# Altium schematic sheet LCD4.3.SchDoc: LCD4.3
size A4; CompanyName: STMicroelectronics; Organization: Microcontrollers Division; DocumentNumber: 16; SheetNumber: 2; SheetTotal: 4
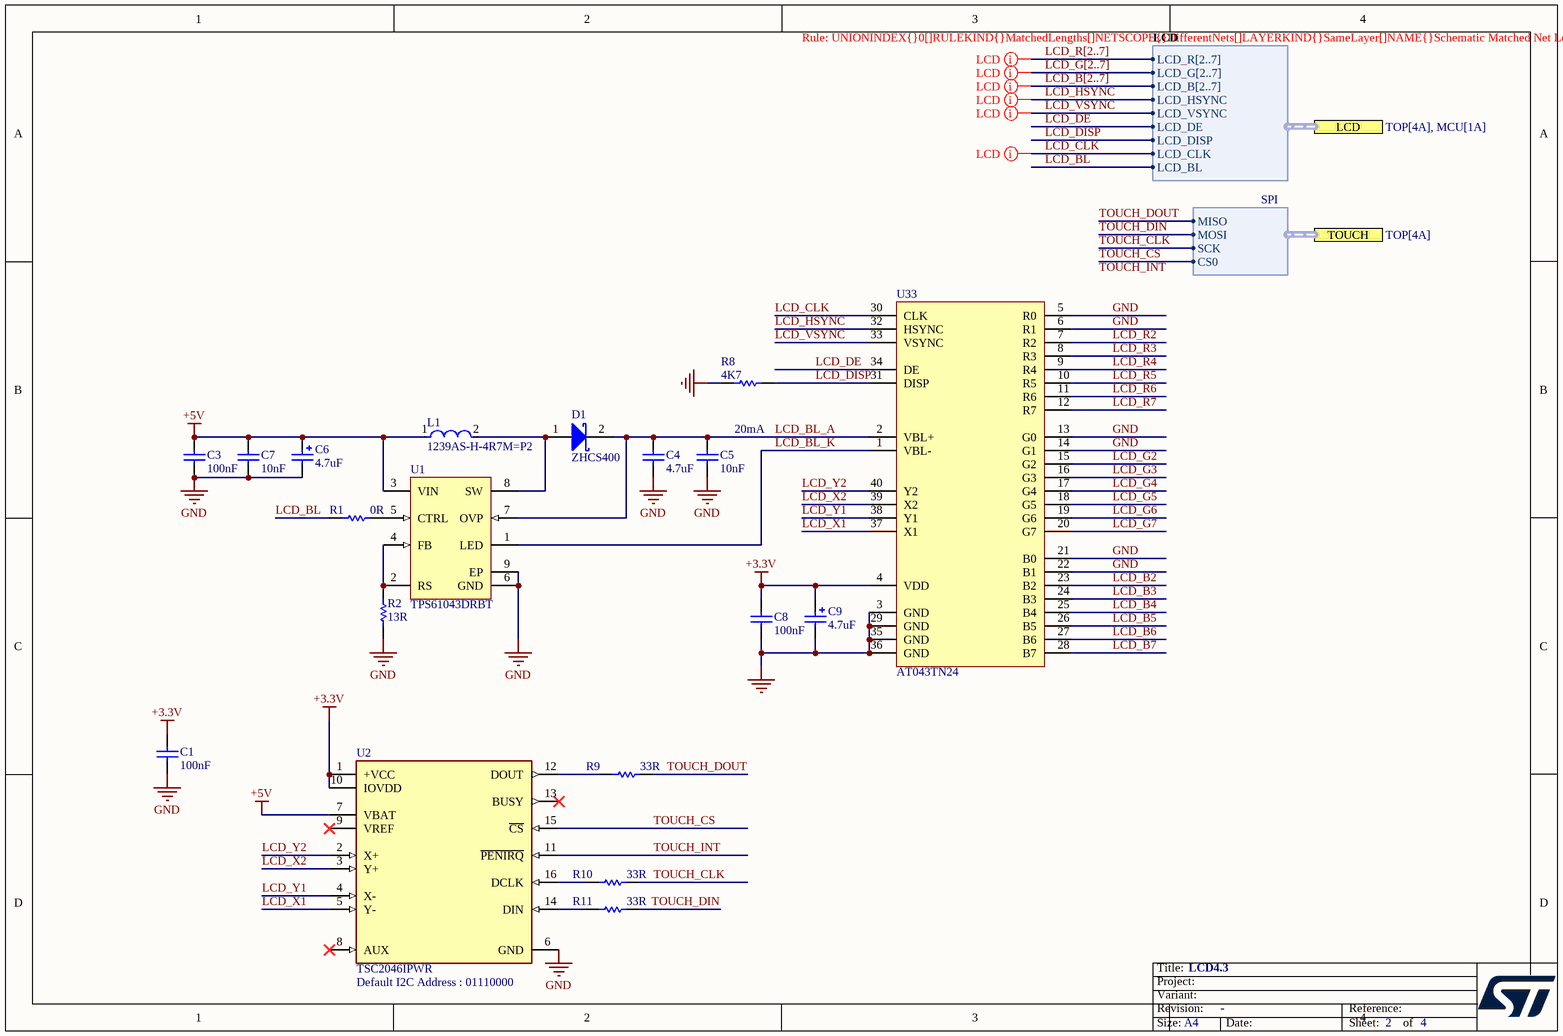
[diagram p0: LCD4.3.SchDoc]

## Parts
C1  value 100nF  [C603]  (hidden comment: Capacitor)
C3  value 100nF  [C603]  (hidden comment: Capacitor)
C4  value 4.7uF  [C1206]  (hidden comment: Capacitor)
C5  value 10nF  [C603]  (hidden comment: Capacitor)
C6  value 4.7uF  [CAP-TAN-A]  (hidden comment: Cap_POL_TANA)
C7  value 10nF  [C603]  (hidden comment: Capacitor)
C8  value 100nF  [C603]  (hidden comment: Capacitor)
C9  value 4.7uF  [CAP-TAN-A]  (hidden comment: Cap_POL_TANA)
D1  ZHCS400  [DIOD-SOD323-2_V]
L1  1239AS-H-4R7M=P2  [FP-DFE252012C-IPC_A]
R1  value 0R  [R0603]  (hidden comment: Resistor)
R2  value 13R  [R805]  (hidden comment: Resistor)
R8  value 4K7  [R0603]  (hidden comment: Resistor)
R9  value 33R  [R0603]  (hidden comment: Resistor)
R10  value 33R  [R0603]  (hidden comment: Resistor)
R11  value 33R  [R0603]  (hidden comment: Resistor)
U1  TPS61043DRBT  [DRB0008A_V]
U2  TSC2046IPWR  [FP-PW0016A-IPC_B]
U33  AT043TN24  [FPC-40]

## Ports
LCD (harness LCD, see TOP[4A], MCU[1A]), TOUCH (harness SPI, see TOP[4A])

## Harnesses
LCD: LCD_R[2..7], LCD_G[2..7], LCD_B[2..7], LCD_HSYNC, LCD_VSYNC, LCD_DE, LCD_DISP, LCD_CLK, LCD_BL
SPI: MOSI, MISO, SCK, CS0

## Nets
+3.3V: C1.2 C8.2 C9.1 U2.1(+VCC) U2.10(IOVDD) U33.4(VDD)
+5V: C3.2 C6.1 C7.2 L1.1 U1.3(VIN) U2.7(VBAT)
GND: C1.1 C3.1 C4.1 C5.1 C6.2 C7.1 C8.1 C9.2 R2.1 R8.1 U1.6(GND) U1.9(EP) U2.6(GND) U33.3(GND) U33.5(R0) U33.6(R1) U33.13(G0) U33.14(G1) U33.21(B0) U33.22(B1) U33.29(GND) U33.35(GND) U33.36(GND)
LCD_B2: U33.23(B2)
LCD_B3: U33.24(B3)
LCD_B4: U33.25(B4)
LCD_B5: U33.26(B5)
LCD_B6: U33.27(B6)
LCD_B7: U33.28(B7)
LCD_BL: R1.1 ; port LCD.LCD_BL
LCD_BL_A: C4.2 C5.2 D1.2(K) U1.7(OVP) U33.2(VBL+)
LCD_BL_K: U1.1(LED) U33.1(VBL-)
LCD_CLK: U33.30(CLK) ; port LCD.LCD_CLK
LCD_DE: U33.34(DE) ; port LCD.LCD_DE
LCD_DISP: R8.2 U33.31(DISP) ; port LCD.LCD_DISP
LCD_G2: U33.15(G2)
LCD_G3: U33.16(G3)
LCD_G4: U33.17(G4)
LCD_G5: U33.18(G5)
LCD_G6: U33.19(G6)
LCD_G7: U33.20(G7)
LCD_HSYNC: U33.32(HSYNC) ; port LCD.LCD_HSYNC
LCD_R2: U33.7(R2)
LCD_R3: U33.8(R3)
LCD_R4: U33.9(R4)
LCD_R5: U33.10(R5)
LCD_R6: U33.11(R6)
LCD_R7: U33.12(R7)
LCD_VSYNC: U33.33(VSYNC) ; port LCD.LCD_VSYNC
LCD_X1: U2.5(Y-) U33.37(X1)
LCD_X2: U2.3(Y+) U33.39(X2)
LCD_Y1: U2.4(X-) U33.38(Y1)
LCD_Y2: U2.2(X+) U33.40(Y2)
TOUCH_CLK: R10.2 ; port TOUCH.SCK
TOUCH_CS: U2.15(~{CS}) ; port TOUCH.CS0
TOUCH_DIN: R11.2 ; port TOUCH.MOSI
TOUCH_DOUT: R9.2 ; port TOUCH.MISO
TOUCH_INT: U2.11(~{PENIRQ})
NetD1_1: D1.1(A) L1.2 U1.8(SW)
NetR1_2: R1.2 U1.5(CTRL)
NetR2_2: R2.2 U1.2(RS) U1.4(FB)
NetR9_1: R9.1 U2.12(DOUT)
NetR10_1: R10.1 U2.16(DCLK)
NetR11_1: R11.1 U2.14(DIN)

Not connected (* = marked no-connect by the designer): U2 8(AUX)* 9(VREF)* 13(BUSY)*

## Buses and harness runs
bus LCD_B[2..7]
bus LCD_G[2..7]
bus LCD_R[2..7]

## Layout directives
rule Matched Net Lengths [Tolerance = 100mil]; net class LCD: (no net found under the mark), LCD_CLK, LCD_HSYNC, LCD_VSYNC

## Notes on the sheet
- 20mA
- (near U2) Default I2C Address : 01110000
- Labels drawn without touching a wire or pin: TOUCH_INT
- Title:
- Project:
- Size:
- Revision:
- Variant:
- A4
- -
- Date:
- Reference:
- Sheet:
- of

## Library data of the parts
C1 C3 C8 = MCD-00102: Capacitor, MLCC, 100nF, 16V, X7R, 10%, 0402, T=0,5mm; Manufacturer_Part_Number: CC0402KRX7R7BB104; Manufacturer: YAGEO; Provided_By: Subcon; Initial_Board_Reference: MB1262; Internal_Part_Number: MCD-00102; Status: Released; Part_Type: Capacitor; Package: C0402; ComponentLink1Description: Yageo_Capacitor_X7R-series.pdf; ComponentLink1URL: http://tunmcdsvn.tun.st.com/Component_Datasheet_Library/Trunk/Capacitors/Yageo_Multilayer_Capacitor_X7R_series_100pF_to_22uF; ECCN_US: n/a; ECCN_EU: n/a
C4 = MCD-00013: Capacitor, MLCC, 4.7uF, 50V, X7R, 10%, 1206, T=1,27mm; Manufacturer_Part_Number: 12065C475KAT2A; Manufacturer: AVX; Provided_By: Subcon; Initial_Board_Reference: MB1274; Internal_Part_Number: MCD-00013; Status: Released; Part_Type: Capacitor; Package: C1206; ComponentLink1Description: AVX_Capacitor_C0G-NP0-series.pdf; ComponentLink1URL: http://tunmcdsvn.tun.st.com/Component_Datasheet_Library/Trunk/Capacitors/AVX_Capacitor_C0G-NP0-series; ECCN_US: n/a; ECCN_EU: n/a
C5 C7 = MCD-00017: Capacitor, MLCC, 10nF, 50V, X7R, 10%, 0603, T=0.8mm; Manufacturer_Part_Number: CC0603KRX7R9BB103; Manufacturer: YAGEO; Provided_By: Subcon; Initial_Board_Reference: MB1274; Internal_Part_Number: MCD-00017; Status: Released; Part_Type: Capacitor; Package: C0603; ComponentLink1Description: Yageo_Capacitor_X7R-series.pdf; ComponentLink1URL: http://tunmcdsvn.tun.st.com/Component_Datasheet_Library/Trunk/Capacitors/Yageo_Multilayer_Capacitor_X7R_series_100pF_to_22uF; ECCN_US: n/a; ECCN_EU: n/a
C6 C9 = MCD-00595: Capacitor, Tantalum, 4.7uF, 16V, +/-10%, 595D case A; Manufacturer_Part_Number: 595D475X9016A2T; Manufacturer: VISHAY; Order_Code_RS: 117-303; Provided_By: Subcon; Initial_Board_Reference: MB1331; Revision: July-2002: Re-released for DXP Platform.; Internal_Part_Number: MCD-00595; Status: Footprint available; Part_Type: Capacitor; ComponentLink1Description: VISHAY_CAPACITOR_TANTALUM_595D.pdf; ComponentLink1URL: http://tunmcdsvn.tun.st.com/Component_Datasheet_Library/Trunk/Capacitors/VISHAY_CAPACITOR_TANTALUM_595D; Order_Code_Digikey: 595D475X9016A2T-ND; Order_Code_Farnell: 1166805
D1 = CMP-0303-00001-1: Schottky Diode, 400mA; Manufacturer: Diodes Inc; Reverse Voltage: 40 V; Power Dissipation: 250 mW; Reverse Current: 40 uA@Vr=30 V; Packing Type: Tape and Reel; Forward Voltage: 425 mV@If=400 mA; PartNumber: ZHCS400; ComponentLink3URL: http://www.diodes.com/datasheets/ap02002.pdf; Moisture Sensitivity Level: 1; ComponentLink2URL: http://www.diodes.com/datasheets/ZHCS400.pdf; PackageDescription: 2-Pin SMT Diode, 1.7 x 1.3 mm Body; ComponentLink2Description: Datasheet; PackageReference: SOD323; ComponentLink1Description: Manufacturer URL; Mounting Technology: Surface Mount; DatasheetVersion: Rev. 8-2, 03/2012; ComponentLink1URL: http://www.diodes.com/; Storage Temperature: -55 to 150 degC; ComponentLink3Description: Package Specification; PackageVersion: Rev. 73
L1 = CMP-06042-003985-1: Shielded Wirewound Inductor 4.7uH 20% 1300mA 0.24Ω 1008 (2520); Current Rating: 1.5A; Core Material: Ferrite; DC Resistance (DCR): 240mR; Test Frequency: 1MHz; Resistor Type: Wirewound; Mount: Surface Mount; Case/Package: 1008; Case Code (Metric): 2520; Inductance: 4.7uH; Width: 0.079inch; Min Operating Temperature: -40°C; Height - Seated (Max): 0.047inch; Length: 0.098inch; Max Operating Temperature: 85°C; Tolerance: 20%; Case Code (Imperial): 1008; Shielding: Shielded; Packaging: Tape and Reel
R1 = MCD-00181: Resistor,0R,0603,ULO; Manufacturer_Part_Number: PMR03EZPJ000; Manufacturer: ROHM; Provided_By: Subcon; Internal_Part_Number: MCD-00181; Status: Released; Part_Type: Resistor; Package: R0603; ComponentLink1Description: ROHM_ULtra low Ohmic Resistor _PMR10EZPJ000.pdf; ComponentLink1URL: http://tunmcdsvn.tun.st.com/Component_Datasheet_Library/Trunk/Resistors/ROHM_ULtra low Ohmic Resistor _PMR10EZPJ000.pdf; ECCN_US: n/a; ECCN_EU: n/a
R2 = MCD-01111: Resistor,10R,0805,1%,Stackpole,1/4W; Manufacturer_Part_Number: RNCP0805FTD10R0; Provided_By: Subcon; Initial_Board_Reference: MB1381; Internal_Part_Number: MCD-01111; Status: Footprint available; Part_Type: Resistor; Manufacturer: STACKPOLE; Package: R0805; ComponentLink1Description: Stackpole_Resisteor_RNCP Series.pdf; ComponentLink1URL: http://tunmcdsvn.tun.st.com/Component_Datasheet_Library/Trunk/Resistors/Stackpole_Resisteor_RNCP%20Series/Stackpole_Resisteor_RNCP%20Series.pdf; ECCN_US: n/a; ECCN_EU: n/a
R8 = MCD-00219: Resistor,4K7,0603,1%,1/10W; Manufacturer_Part_Number: RC0603FR-074K7L; Manufacturer: YAGEO; Provided_By: Subcon; Initial_Board_Reference: mb1319; Internal_Part_Number: MCD-00219; Status: Released; Part_Type: Resistor; Package: R0603; ComponentLink1Description: Yageo_Resistor_RC0603-series.pdf; ComponentLink1URL: http://tunmcdsvn.tun.st.com/Component_Datasheet_Library/Trunk/Resistors/Yageo_Resistor_RC0603-series.pdf; ECCN_US: n/a; ECCN_EU: n/a
R9-R11 = MCD-00455: Resistor,33R,0402,1%,1/16W; Manufacturer_Part_Number: RC0402FR-0733RL; Manufacturer: YAGEO; Provided_By: Subcon; Internal_Part_Number: MCD-00455; Status: Released; Part_Type: Resistor; Package: R0402; ComponentLink1Description: Yageo_Resistor_RC0402-series.pdf; ComponentLink1URL: http://tunmcdsvn.tun.st.com/Component_Datasheet_Library/Trunk/Resistors/Yageo_Resistor_RC0402-series; ECCN_US: n/a; ECCN_EU: n/a
U1 = CMP-0343-00068-4: Boost LED Driver with 1.8 to 6 V Input and 1.8 to 16.9 V Output, -40 to 85 degC, 8-Pin SON (DRB), Green (RoHS & no Sb/Br); Manufacturer: Texas Instruments; Vout(Min)(V): 1.8; Switching Frequency(Max)(kHz): 1000; Vout(Max)(V): 16.9; Vin(Max)(V): 6; Regulated Outputs(#): 1; SubFamily: Step-Up Regulator; PackageVersion: revI, Sep-2010; ComponentLink2Description: Package Specification; Topology: Boost; ComponentLink1Description: Datasheet; Mounting Technology: Surface Mount; PackageDescription: 8-Pin Plastic Small Outline No-Lead, 3 x 3 x 1 mm Body, 0.65 mm Pitch, Exposed Pad; DatasheetVersion: SLVS465A; Eco-Plan: Green (RoHS & no Sb/Br); PackageReference: DRB0008A; ComponentLink1URL: http://www.ti.com/general/docs/lit/getliterature.tsp?genericPartNumber=TPS61043&fileType=pdf; ComponentLink2URL: http://www.ti.com/lit/ml/mpds118j/mpds118j.pdf; PartNumber: TPS61043DRBT; Vin(Min)(V): 1.8
U2 = CMP-04863-000001-1: IC SCREEN CNTRL 12BIT 16TSSOP; Sampling Rate: 125KS/s; Interface: SPI; Max Supply Voltage: 5.25V; Touchscreen: Resistive; Resolution: 12b; Number of Bits: 12; Operating Supply Current: 780uA; Number of Channels: 6; Min Supply Voltage: 2.2V; Weight: 0.002183oz; Number of Pins: 16; Contact Plating: Gold; Mount: Surface Mount; Case/Package: TSSOP; Radiation Hardening: No; Packaging: Tape and Reel; RoHS Compliant: Yes; Max Operating Temperature: 85°C; Length: 5mm; Height: 1.15mm; Width: 4.4mm; Package Quantity: 1; Min Operating Temperature: -40°C; Series: TSC2046; REACH SVHC: No SVHC; Lead Free: Lead Free
U33 = AT043TN24: LCD,  TFT, 4.3 inch, 480x272 pixels with LED Backlight and touch panel, high luminance with 0.5mm pitch flat cable; Internal_Part_Number: MCD-02422; Part_Type: Display; Part_Preference: Recommended; Manufacturer: ROCKTECH; Manufacturer_Part_Number: RK043FN78HV-CT661C; Component_Country_Of_Origin: Unknown; ShowFields: YES; ID: 4528; Value: AT043TN24; Order_code_Digikey: N/A; Order_code_Farnell: N/A; Order_code_RS: N/A; Status: Released; ComponentLink1URL: https://www.emtronix.com/download/AT043TN24-480272.pdf; ComponentLink1Description: datasheet